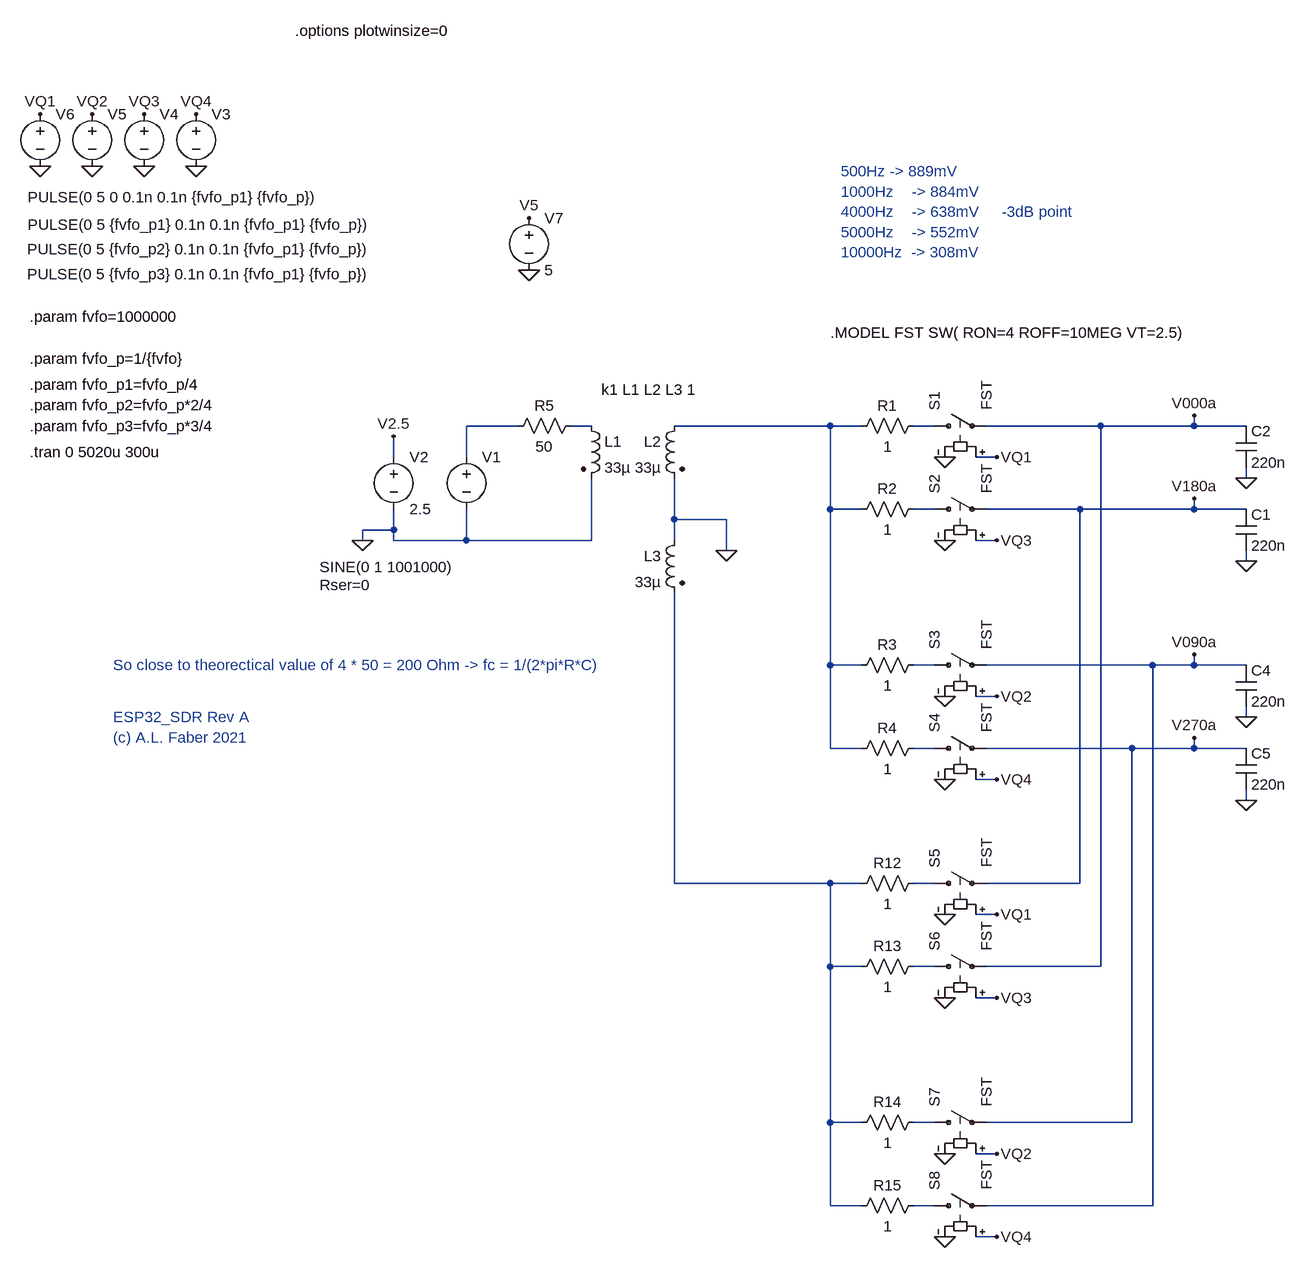
[diagram p0: schematic qsd_switch_impedance.asc]
qsd_switch_impedance.asc, the LTspice schematic file:
Version 4
SHEET 1 2036 1292
WIRE 128 -16 48 -16
WIRE 240 -16 208 -16
WIRE 608 -16 368 -16
WIRE 656 -16 608 -16
WIRE 768 -16 736 -16
WIRE 1024 -16 848 -16
WIRE 1168 -16 1168 -32
WIRE 1168 -16 1024 -16
WIRE 1248 -16 1168 -16
WIRE -64 32 -64 0
WIRE 48 32 48 -16
WIRE 864 32 832 32
WIRE 1248 64 1248 48
WIRE 608 112 608 -16
WIRE 656 112 608 112
WIRE 768 112 736 112
WIRE 992 112 848 112
WIRE 1168 112 1168 96
WIRE 1168 112 992 112
WIRE 1248 112 1168 112
WIRE 368 128 368 64
WIRE 448 128 368 128
WIRE -64 144 -64 112
WIRE -64 144 -112 144
WIRE -112 160 -112 144
WIRE -64 160 -64 144
WIRE 48 160 48 112
WIRE 48 160 -64 160
WIRE 240 160 240 64
WIRE 240 160 48 160
WIRE 368 160 368 128
WIRE 864 160 832 160
WIRE 448 176 448 128
WIRE 1248 192 1248 176
WIRE 608 352 608 112
WIRE 656 352 608 352
WIRE 768 352 736 352
WIRE 1104 352 848 352
WIRE 1168 352 1168 336
WIRE 1168 352 1104 352
WIRE 1248 352 1168 352
WIRE 864 400 832 400
WIRE 1248 432 1248 416
WIRE 608 480 608 352
WIRE 656 480 608 480
WIRE 768 480 736 480
WIRE 1072 480 848 480
WIRE 1168 480 1168 464
WIRE 1168 480 1072 480
WIRE 1248 480 1168 480
WIRE 864 528 832 528
WIRE 1248 560 1248 544
WIRE 368 688 368 240
WIRE 608 688 368 688
WIRE 656 688 608 688
WIRE 768 688 736 688
WIRE 992 688 992 112
WIRE 992 688 848 688
WIRE 864 736 832 736
WIRE 608 816 608 688
WIRE 656 816 608 816
WIRE 768 816 736 816
WIRE 1024 816 1024 -16
WIRE 1024 816 848 816
WIRE 864 864 832 864
WIRE 608 1056 608 816
WIRE 656 1056 608 1056
WIRE 768 1056 736 1056
WIRE 1072 1056 1072 480
WIRE 1072 1056 848 1056
WIRE 864 1104 832 1104
WIRE 608 1184 608 1056
WIRE 656 1184 608 1184
WIRE 768 1184 736 1184
WIRE 1104 1184 1104 352
WIRE 1104 1184 848 1184
WIRE 864 1232 832 1232
FLAG -64 0 V2.5
FLAG -608 -496 VQ1
FLAG -528 -496 VQ2
FLAG -448 -496 VQ3
FLAG -368 -496 VQ4
FLAG -608 -416 0
FLAG -528 -416 0
FLAG -448 -416 0
FLAG -368 -416 0
FLAG 144 -256 0
FLAG 144 -336 V5
FLAG -112 160 0
FLAG 864 32 VQ1
FLAG 784 32 0
FLAG 1248 64 0
FLAG 864 160 VQ3
FLAG 784 160 0
FLAG 1248 192 0
FLAG 1168 -32 V000a
FLAG 1168 96 V180a
FLAG 864 400 VQ2
FLAG 784 400 0
FLAG 1248 432 0
FLAG 864 528 VQ4
FLAG 784 528 0
FLAG 1248 560 0
FLAG 1168 336 V090a
FLAG 1168 464 V270a
FLAG 864 736 VQ1
FLAG 784 736 0
FLAG 864 864 VQ3
FLAG 784 864 0
FLAG 864 1104 VQ2
FLAG 784 1104 0
FLAG 864 1232 VQ4
FLAG 784 1232 0
FLAG 448 176 0
SYMBOL voltage 48 16 R0
WINDOW 3 -226 185 Left 2
WINDOW 123 0 0 Left 0
WINDOW 39 -226 213 Left 2
SYMATTR Value SINE(0 1 1001000)
SYMATTR SpiceLine Rser=0
SYMATTR InstName V1
SYMBOL voltage -64 16 R0
WINDOW 123 0 0 Left 0
WINDOW 39 0 0 Left 0
SYMATTR InstName V2
SYMATTR Value 2.5
SYMBOL voltage -368 -512 R0
WINDOW 3 -260 262 Left 2
WINDOW 123 0 0 Left 0
WINDOW 39 0 0 Left 0
SYMATTR Value PULSE(0 5 {fvfo_p3} 0.1n 0.1n {fvfo_p1} {fvfo_p})
SYMATTR InstName V3
SYMBOL voltage -448 -512 R0
WINDOW 3 -180 224 Left 2
WINDOW 123 0 0 Left 0
WINDOW 39 0 0 Left 0
SYMATTR Value PULSE(0 5 {fvfo_p2} 0.1n 0.1n {fvfo_p1} {fvfo_p})
SYMATTR InstName V4
SYMBOL voltage -528 -512 R0
WINDOW 3 -99 186 Left 2
WINDOW 123 0 0 Left 0
WINDOW 39 0 0 Left 0
SYMATTR Value PULSE(0 5 {fvfo_p1} 0.1n 0.1n {fvfo_p1} {fvfo_p})
SYMATTR InstName V5
SYMBOL voltage -608 -512 R0
WINDOW 3 -19 144 Left 2
WINDOW 123 0 0 Left 0
WINDOW 39 0 0 Left 0
SYMATTR Value PULSE(0 5 0 0.1n 0.1n {fvfo_p1} {fvfo_p})
SYMATTR InstName V6
SYMBOL voltage 144 -352 R0
WINDOW 123 0 0 Left 0
WINDOW 39 0 0 Left 0
SYMATTR InstName V7
SYMATTR Value 5
SYMBOL res 224 -32 R90
WINDOW 0 0 56 VBottom 2
WINDOW 3 32 56 VTop 2
SYMATTR InstName R5
SYMATTR Value 50
SYMBOL sw 752 -16 R270
SYMATTR InstName S1
SYMATTR Value FST
SYMBOL cap 1232 -16 R0
SYMATTR InstName C2
SYMATTR Value 220n
SYMBOL res 752 -32 R90
WINDOW 0 0 56 VBottom 2
WINDOW 3 32 56 VTop 2
SYMATTR InstName R1
SYMATTR Value 1
SYMBOL ind2 224 -32 R0
SYMATTR InstName L1
SYMATTR Value 33µ
SYMATTR Type ind
SYMBOL ind2 384 -32 M0
SYMATTR InstName L2
SYMATTR Value 33µ
SYMATTR Type ind
SYMBOL sw 752 112 R270
SYMATTR InstName S2
SYMATTR Value FST
SYMBOL cap 1232 112 R0
SYMATTR InstName C1
SYMATTR Value 220n
SYMBOL res 752 96 R90
WINDOW 0 0 56 VBottom 2
WINDOW 3 32 56 VTop 2
SYMATTR InstName R2
SYMATTR Value 1
SYMBOL sw 752 352 R270
SYMATTR InstName S3
SYMATTR Value FST
SYMBOL cap 1232 352 R0
SYMATTR InstName C4
SYMATTR Value 220n
SYMBOL res 752 336 R90
WINDOW 0 0 56 VBottom 2
WINDOW 3 32 56 VTop 2
SYMATTR InstName R3
SYMATTR Value 1
SYMBOL sw 752 480 R270
SYMATTR InstName S4
SYMATTR Value FST
SYMBOL cap 1232 480 R0
SYMATTR InstName C5
SYMATTR Value 220n
SYMBOL res 752 464 R90
WINDOW 0 0 56 VBottom 2
WINDOW 3 32 56 VTop 2
SYMATTR InstName R4
SYMATTR Value 1
SYMBOL sw 752 688 R270
SYMATTR InstName S5
SYMATTR Value FST
SYMBOL res 752 672 R90
WINDOW 0 0 56 VBottom 2
WINDOW 3 32 56 VTop 2
SYMATTR InstName R12
SYMATTR Value 1
SYMBOL sw 752 816 R270
SYMATTR InstName S6
SYMATTR Value FST
SYMBOL res 752 800 R90
WINDOW 0 0 56 VBottom 2
WINDOW 3 32 56 VTop 2
SYMATTR InstName R13
SYMATTR Value 1
SYMBOL sw 752 1056 R270
SYMATTR InstName S7
SYMATTR Value FST
SYMBOL res 752 1040 R90
WINDOW 0 0 56 VBottom 2
WINDOW 3 32 56 VTop 2
SYMATTR InstName R14
SYMATTR Value 1
SYMBOL sw 752 1184 R270
SYMATTR InstName S8
SYMATTR Value FST
SYMBOL res 752 1168 R90
WINDOW 0 0 56 VBottom 2
WINDOW 3 32 56 VTop 2
SYMATTR InstName R15
SYMATTR Value 1
SYMBOL ind2 384 144 M0
SYMATTR InstName L3
SYMATTR Value 33µ
SYMATTR Type ind
TEXT -624 -184 Left 2 !.param fvfo=1000000
TEXT -624 24 Left 2 !.tran 0 5020u 300u
TEXT -624 -120 Left 2 !.param fvfo_p=1/{fvfo}
TEXT -624 -80 Left 2 !.param fvfo_p1=fvfo_p/4
TEXT -624 -48 Left 2 !.param fvfo_p2=fvfo_p*2/4
TEXT -624 -16 Left 2 !.param fvfo_p3=fvfo_p*3/4
TEXT -216 -624 Left 2 !.options plotwinsize=0
TEXT 608 -160 Left 2 !.MODEL FST SW( RON=4 ROFF=10MEG VT=2.5)
TEXT 256 -72 Left 2 !k1 L1 L2 L3 1
TEXT 624 -408 Left 2 ;500Hz -> 889mV\n1000Hz    -> 884mV\n4000Hz    -> 638mV     -3dB point\n5000Hz    -> 552mV\n10000Hz  -> 308mV
TEXT -496 352 Left 2 ;So close to theorectical value of 4 * 50 = 200 Ohm -> fc = 1/(2*pi*R*C)
TEXT -496 432 Left 2 ;ESP32_SDR Rev A\n(c) A.L. Faber 2021

The netlist it stands for:
* qsd_switch_impedance.asc
V1 N001 0 SINE(0 1 1001000) Rser=0
V2 V2.5 0 2.5
V3 VQ4 0 PULSE(0 5 {fvfo_p3} 0.1n 0.1n {fvfo_p1} {fvfo_p})
V4 VQ3 0 PULSE(0 5 {fvfo_p2} 0.1n 0.1n {fvfo_p1} {fvfo_p})
V5 VQ2 0 PULSE(0 5 {fvfo_p1} 0.1n 0.1n {fvfo_p1} {fvfo_p})
V6 VQ1 0 PULSE(0 5 0 0.1n 0.1n {fvfo_p1} {fvfo_p})
V7 V5 0 5
R5 N002 N001 50
S1 N004 V000a VQ1 0 FST
C2 V000a 0 220n
R1 N004 N003 1
L1 N002 0 33µ
L2 N003 0 33µ
S2 N005 V180a VQ3 0 FST
C1 V180a 0 220n
R2 N005 N003 1
S3 N006 V090a VQ2 0 FST
C4 V090a 0 220n
R3 N006 N003 1
S4 N007 V270a VQ4 0 FST
C5 V270a 0 220n
R4 N007 N003 1
S5 N009 V180a VQ1 0 FST
R12 N009 N008 1
S6 N010 V000a VQ3 0 FST
R13 N010 N008 1
S7 N011 V270a VQ2 0 FST
R14 N011 N008 1
S8 N012 V090a VQ4 0 FST
R15 N012 N008 1
L3 0 N008 33µ
.param fvfo=1000000
.tran 0 5020u 300u
.param fvfo_p=1/{fvfo}
.param fvfo_p1=fvfo_p/4
.param fvfo_p2=fvfo_p*2/4
.param fvfo_p3=fvfo_p*3/4
.options plotwinsize=0
.MODEL FST SW( RON=4 ROFF=10MEG VT=2.5)
k1 L1 L2 L3 1
* 500Hz -> 889mV
* 1000Hz    -> 884mV
* 4000Hz    -> 638mV     -3dB point
* 5000Hz    -> 552mV
* 10000Hz  -> 308mV
* So close to theorectical value of 4 * 50 = 200 Ohm -> fc = 1/(2*pi*R*C)
* ESP32_SDR Rev A
* (c) A.L. Faber 2021
.backanno
.end